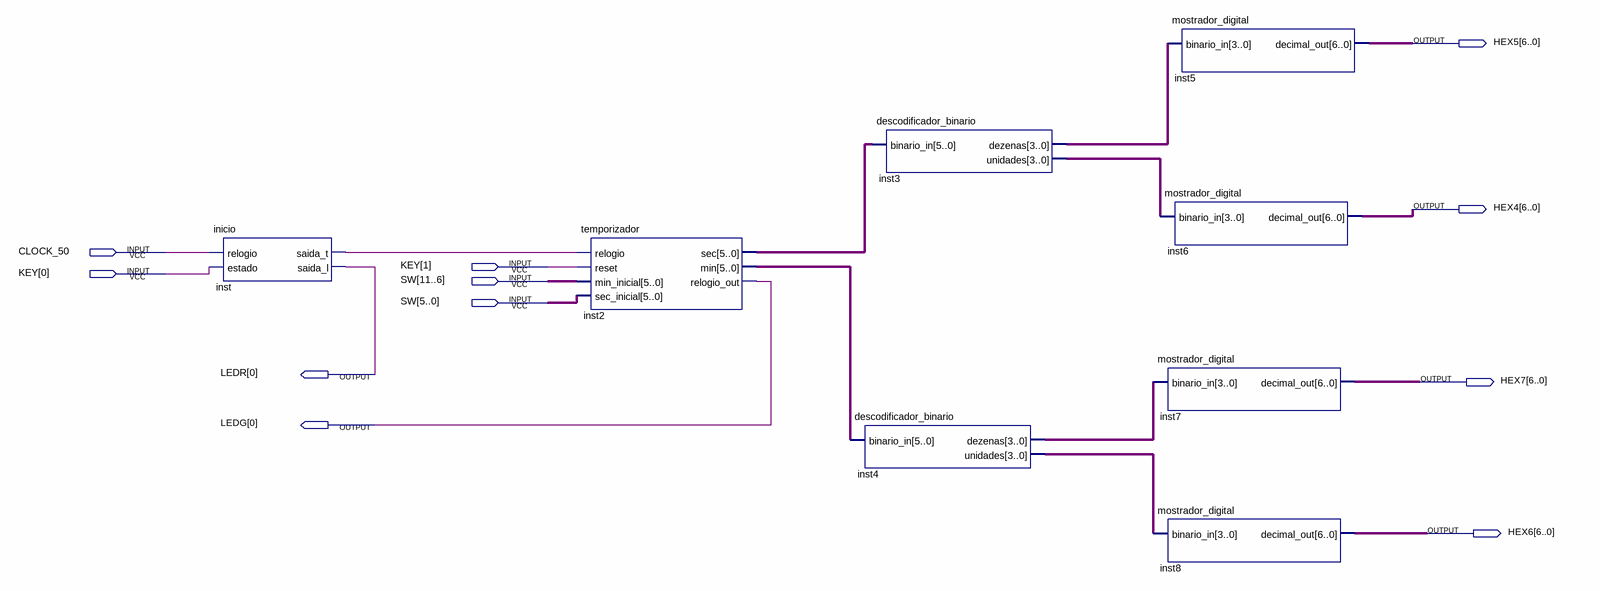
[diagram p0: schematic sheet]
// Quartus schematic esquematico.bdf as structural Verilog: 8 symbols, 11 pins
module esquematico (
  input  CLOCK_50,
  input  [1:0] KEY,
  input  [11:0] SW,
  output [6:0] HEX5,
  output [6:0] HEX4,
  output [0:0] LEDR,
  output [6:0] HEX7,
  output [0:0] LEDG,
  output [6:0] HEX6
);

  wire inst_saida_t;
  wire [3:0] inst3_dezenas, inst3_unidades, inst4_dezenas, inst4_unidades;
  wire [5:0] inst2_min, inst2_sec;

  inicio inst (.relogio(CLOCK_50), .estado(KEY[0]), .saida_t(inst_saida_t), .saida_l(LEDR[0]));
  temporizador inst2 (
    .relogio(inst_saida_t), .reset(KEY[1]), .min_inicial(SW[11:6]), .sec_inicial(SW[5:0]), .sec(inst2_sec),
    .min(inst2_min), .relogio_out(LEDG[0]));
  descodificador_binario inst3 (.binario_in(inst2_sec), .dezenas(inst3_dezenas), .unidades(inst3_unidades));
  descodificador_binario inst4 (.binario_in(inst2_min), .dezenas(inst4_dezenas), .unidades(inst4_unidades));
  mostrador_digital inst5 (.binario_in(inst3_dezenas), .decimal_out(HEX5));
  mostrador_digital inst6 (.binario_in(inst3_unidades), .decimal_out(HEX4));
  mostrador_digital inst7 (.binario_in(inst4_dezenas), .decimal_out(HEX7));
  mostrador_digital inst8 (.binario_in(inst4_unidades), .decimal_out(HEX6));
endmodule
